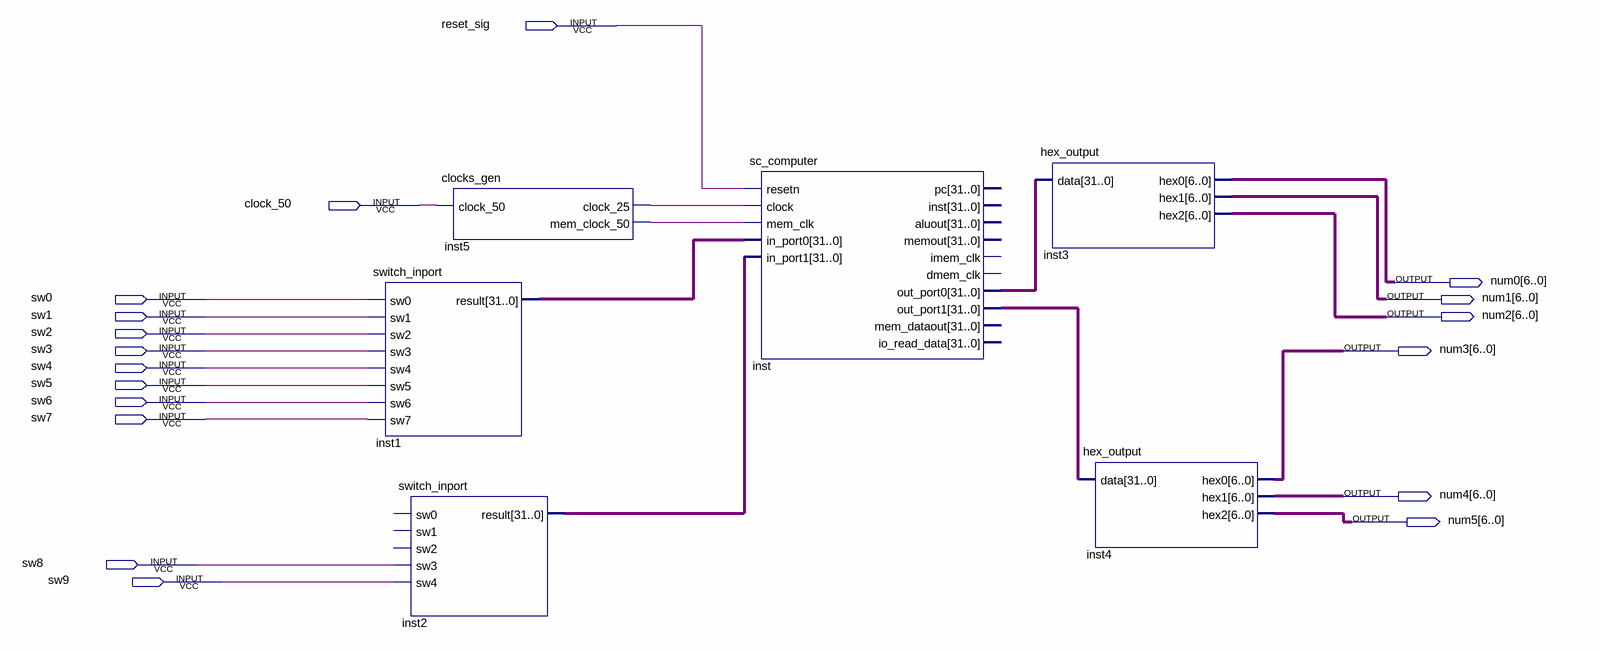
[diagram p0: schematic sheet]
// Quartus schematic my_single_cycle_cpu.bdf as structural Verilog: 6 symbols, 18 pins
module my_single_cycle_cpu (
  input  reset_sig,
  input  clock_50,
  input  sw0,
  input  sw1,
  input  sw2,
  input  sw3,
  input  sw4,
  input  sw5,
  input  sw6,
  input  sw7,
  input  sw8,
  input  sw9,
  output [6:0] num0,
  output [6:0] num1,
  output [6:0] num2,
  output [6:0] num3,
  output [6:0] num4,
  output [6:0] num5
);

  wire inst5_clock_25, inst5_mem_clock_50;
  wire [31:0] inst1_result, inst2_result, inst_out_port0, inst_out_port1;

  switch_inport inst1 (
    .sw0(sw0), .sw1(sw1), .sw2(sw2), .sw3(sw3), .sw4(sw4), .sw5(sw5), .sw6(sw6), .sw7(sw7),
    .result(inst1_result));
  clocks_gen inst5 (.clock_50(clock_50), .clock_25(inst5_clock_25), .mem_clock_50(inst5_mem_clock_50));
  switch_inport inst2 (.sw3(sw8), .sw4(sw9), .result(inst2_result));  // open: sw0, sw1, sw2
  sc_computer inst (
    .resetn(reset_sig), .clock(inst5_clock_25), .mem_clk(inst5_mem_clock_50), .in_port0(inst1_result),
    .in_port1(inst2_result), .out_port0(inst_out_port0), .out_port1(inst_out_port1));  // open: pc, inst, aluout, memout, imem_clk, dmem_clk, mem_dataout, io_read_data
  hex_output inst3 (.data(inst_out_port0), .hex0(num0), .hex1(num1), .hex2(num2));
  hex_output inst4 (.data(inst_out_port1), .hex0(num3), .hex1(num4), .hex2(num5));
endmodule
